# Altium schematic sheet M.SchDoc
size A
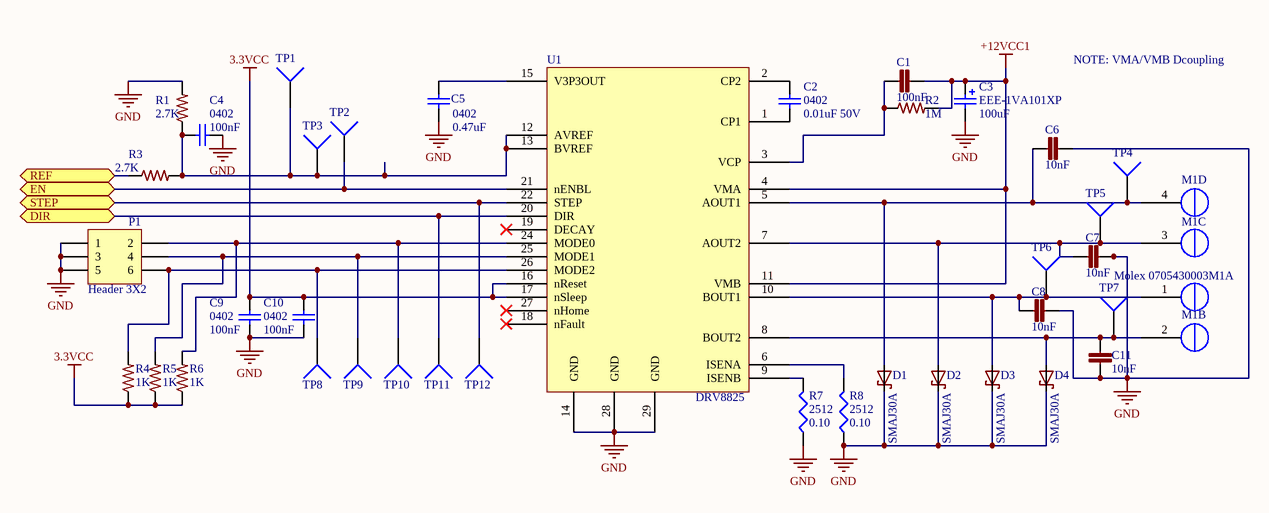
[diagram p0: M.SchDoc]

## Parts
C1  100nF  [C0603]
C2  value 0.01uF 50V  [C0402]  (hidden comment: 0402)
C3  EEE-1VA101XP  value 100uF  [EEE-1VA101XP]
C4  value 100nF  [C0402]  (hidden comment: 0402)
C5  value 0.47uF  [C0402]  (hidden comment: 0402)
C6  10nF  [C0603]
C7  10nF  [C0603]
C8  10nF  [C0603]
C9  value 100nF  [C0402]  (hidden comment: 0402)
C10  value 100nF  [C0402]  (hidden comment: 0402)
C11  10nF  [C0603]
D1  SMAJ30A  [SMA-SM]
D2  SMAJ30A  [SMA-SM]
D3  SMAJ30A  [SMA-SM]
D4  SMAJ30A  [SMA-SM]
M1  Molex 0705430003  [4POL254]  (parts A,B,C,D of 4)
P1  Header 3X2  [HDR2X3]
R1  2.7K  [R0402]
R2  1M  [R0402]
R3  2.7K  [R0402]
R4  1K  [R0603]
R5  1K  [R0603]
R6  1K  [R0603]
R7  2512  value 0.10  [2512R-0.55]
R8  2512  value 0.10  [2512R-0.55]
TP1  TP4  [TP-2]  (value not drawn)
TP2  TP4  [TP-2]  (value not drawn)
TP3  TP4  [TP-2]  (value not drawn)
TP4  TP4  [TP-2]  (value not drawn)
TP5  TP4  [TP-2]  (value not drawn)
TP6  TP4  [TP-2]  (value not drawn)
TP7  TP4  [TP-2]  (value not drawn)
TP8  TP4  [TP-2]  (value not drawn)
TP9  TP4  [TP-2]  (value not drawn)
TP10  TP4  [TP-2]  (value not drawn)
TP11  TP4  [TP-2]  (value not drawn)
TP12  TP4  [TP-2]  (value not drawn)
U1  DRV8825  [DRV8825]

## Ports
DIR, EN, REF, STEP

## Nets
3.3VCC: C9.2 C10.2 R4.1 R5.1 R6.1 U1.16(nReset) U1.17(nSleep)
+12VCC1: C1.2 C3.1 R2.2 U1.4(VMA) U1.11(VMB)
GND: C3.2 C4.1 C5.1 C6.2 C7.2 C8.2 C9.1 C10.1 C11.1 D1.C D2.C D3.C D4.C P1.1 P1.3 P1.5 R1.2 R7.1 R8.1 U1.14(GND) U1.28(GND) U1.29(GND)
DIR: TP11.1 U1.20(DIR) ; port DIR
EN: TP2.1 U1.21(nENBL) ; port EN
REF: R3.1 ; port REF
STEP: TP12.1 U1.22(STEP) ; port STEP
NetC1_1: C1.1 R2.1 U1.3(VCP)
NetC2_1: C2.1 U1.1(CP1)
NetC2_2: C2.2 U1.2(CP2)
NetC4_2: C4.2 R1.1 R3.2 TP1.1 TP3.1 U1.12(AVREF) U1.13(BVREF)
NetC5_2: C5.2 U1.15(V3P3OUT)
NetC6_1: C6.1 D1.A M1.4(OUT1B) TP4.1 U1.5(AOUT1)
NetC7_1: C7.1 D2.A M1.3(OUT1A) TP5.1 U1.7(AOUT2)
NetC8_1: C8.1 D3.A M1.1(OUT2B) TP6.1 U1.10(BOUT1)
NetC11_2: C11.2 D4.A M1.2(OUT2A) TP7.1 U1.8(BOUT2)
NetP1_2: P1.2 R6.2 TP10.1 U1.24(MODE0)
NetP1_4: P1.4 R5.2 TP9.1 U1.25(MODE1)
NetP1_6: P1.6 R4.2 TP8.1 U1.26(MODE2)
NetR7_2: R7.2 U1.9(ISENB)
NetR8_2: R8.2 U1.6(ISENA)

Not connected (* = marked no-connect by the designer): U1 18(nFault)* 19(DECAY)* 23(NC) 27(nHome)*

## Notes on the sheet
- NOTE: VMA/VMB Dcoupling

## Library data of the parts
C1 = C0603C104K5RACTU: CAP CER 0603 100nF 50V 10% X7R; LastRevisionNote: ImportComponents; Published: 23-Apr-2014; Publisher: UltiMachine; LastRevisionDate: 23-Apr-2014; ManufacturerPartNumber: C0603C104K5RACTU; VALUE: 100nF
C2 = GRM155R71H103JA88D: CAP CER 10000PF 50V X7R 0402; MFR: Murata; Tolerance: 10%; Voltage: 6.3VDC; Published: 10 - Dec - 2014; LatestRevisionDate: 10 - Dec - 2014; LatestRevisionNote: Ultimachine Footprint Added; Publisher: Ultimachine; Component Type: Chip Capacitor; MFR Part #: GRM155R71H103JA88D; Part Description: CAP CER 10000PF 50V X7R 0402; Mounting Type: SMT 0402; Datasheet: http://search.murata.co.jp/Ceramy/image/img/A01X/G101/ENG/GRM155R71H103JA88-01.pdf; Height: 0.5 ±0.05mm; Digikey #: 490-7763-1-ND; PackageReference: 0402
C3 = EEE-1VA101XP: CAP ALUM 100UF 35V 20% SMD; Manufacture: Panasonic; Digikey Part #: PCE3951CT-ND; Price: $0.63; Mount Type: SMT Panasonic VS D Series; Status: Active; Height: 7.70mm; Datasheet: http://industrial.panasonic.com/www-cgi/jvcr13pz.cgi?E+PZ+3+ABA0002+EEE1VA101XP+7+WW; Manufacture Part #: EEE-1VA101XP
C4 C9 C10 = 100nF C0402 - GRM155R71C104KA88D: Capacitor (Semiconductor SIM Model); MFR: Murata; Part Description: CAP CER 0.1UF 16V 10% X7R 0402; Tolerance: 10%; Voltage: 16v; Published: 10 - Dec - 2014; LatestRevisionDate: 10 - Dec - 2014; LatestRevisionNote: Ultimachine Footprint Added; Publisher: Ultimachine; Component Type: Chip Capacitor; MFR Part #: GRM155R71C104KA88D; Mounting Type: SMT 0402; Datasheet: http://psearch.murata.com/capacitor/product/GRM155R71C104KA88%23.pdf; Height: 0.5 ±0.05mm; PackageReference: 0402
C5 = GRM155R60J474KE19D: 0.47uF 6.3v C0402 - GRM155R60J474KE19D; MFR: Murata; Part Description: CAP CER 0.47UF 6.3V 10% X5R 0402; Tolerance: 10%; Voltage: 6.3VDC; Published: 10 - Dec - 2014; LatestRevisionDate: 10 - Dec - 2014; LatestRevisionNote: Ultimachine Footprint Added; Publisher: Ultimachine; Component Type: Chip Capacitor; MFR Part #: GRM155R60J474KE19D; Mounting Type: SMT 0402; Datasheet: http://search.murata.co.jp/Ceramy/image/img/A01X/G101/ENG/GRM155R60J474KE19-01.pdf; Height: 0.5 ±0.05mm; PackageReference: 0402
C6-C8 C11 = C1608X7R1E103K080AA: CAP CER 0603 10nF 25V 10% X7R; LastRevisionNote: ImportComponents; Published: 23-Apr-2014; Publisher: UltiMachine; LastRevisionDate: 23-Apr-2014; ManufacturerPartNumber: C1608X7R1E103K080AA; VALUE: 10nF
D1-D4 = SMAJ30A: DIODE TVS 30V SMA; LastRevisionNote: ImportComponents; Published: 23-Apr-2014; Publisher: UltiMachine; LastRevisionDate: 23-Apr-2014; ManufacturerPartNumber: SMAJ30A
M1 = Molex 0705430003 Alt: Molex 4 Pin Clip Connector
P1 = Header 3X2: Header, 3-Pin, Dual row; LatestRevisionDate: 17-Jul-2002; LatestRevisionNote: Re-released for DXP Platform.; Publisher: Altium Limited
R1 R3 = ERJ-2RKF2701X: RES SMD 2.7K OHM 1% 1/10W 0402; Manufacturer: Panasonic; ManufacturerPartNumber: ERJ2GEJ105X; LastRevisionNote: ImportComponents; Published: 23-Apr-2014; Publisher: Adam; LastRevisionDate: 23-Apr-2014; VALUE: 2.7K
R2 = ERJ2GEJ105X: RES 0402 1M 100mW 5%; LastRevisionNote: ImportComponents; Published: 23-Apr-2014; Publisher: UltiMachine; LastRevisionDate: 23-Apr-2014; ManufacturerPartNumber: ERJ2GEJ105X; VALUE: 1M
R4-R6 = ERJ-3EKF1001V: RES 0603 1K 100mW 1%; LastRevisionNote: ImportComponents; Published: 23-Apr-2014; Publisher: UltiMachine; LastRevisionDate: 23-Apr-2014; ManufacturerPartNumber: ERJ-3EKF1001V; VALUE: 1K
R7 R8 = CSRN2512FTR100: RES SMD 0.1 OHM 1% 2W 2512; MFR: Stackpole ELectronics Inc; PackageReference: 2512; MFR #: CSRN2512FTR100; Digikey #: CSRN2512FTR100TR-ND; PDF: http://www.seielect.com/catalog/SEI-CSR_CSRN.pdf
TP1-TP12 = Socket: LatestRevisionDate: 17-Jul-2002; LatestRevisionNote: Re-released for DXP Platform.; Publisher: Altium Limited
U1 = DRV8825: DRV8825 Ti Stepper Driver